# Altium schematic sheet sensor.SchDoc: Bison-Board
size A4; DrawnBy: mzy2364; Revision: V1.4
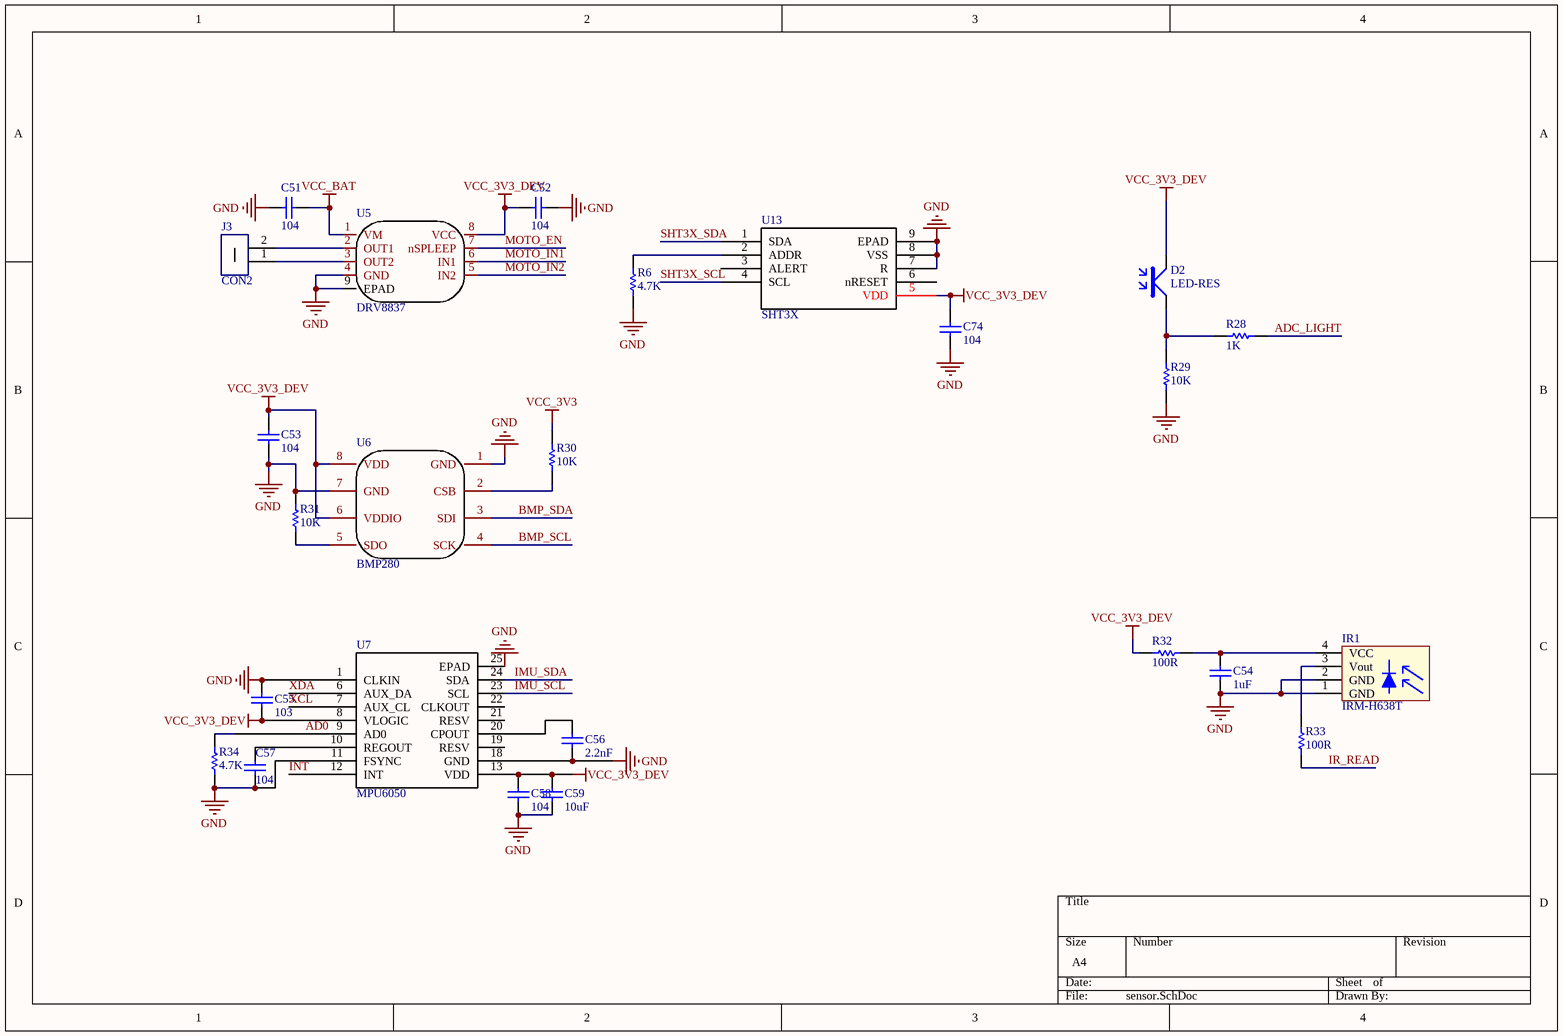
[diagram p0: sensor.SchDoc]

## Parts
C51  104  [C 0603]
C52  104  [C 0603]
C53  104  [C 0603]
C54  1uF  [C 0603]
C55  103  [C 0603]
C56  2.2nF  [C 0603]
C57  104  [C 0603]
C58  104  [C 0603]
C59  10uF  [C 0603]
C74  104  [C 0603]
D2  LED-RES  [LED 0805]
IR1  IRM-H638T  [IRM-H638T]
J3  CON2  [SMD_2P-1.25]
R6  4.7K  [R 0603]
R28  1K  [R 0603]
R29  10K  [R 0603]
R30  10K  [R 0603]
R31  10K  [R 0603]
R32  100R  [R 0603]
R33  100R  [R 0603]
R34  4.7K  [R 0603]
U5  DRV8837  [WSON-8]
U6  BMP280  [LGA-8]
U7  MPU6050  [QFN-24]
U13  SHT3X  [DFN-8]

## Nets
GND: C51.1 C52.2 C53.1 C54.2 C55.2 C56.2 C57.1 C58.1 C59.1 C74.2 IR1.1(GND) IR1.2(GND) R6.1 R29.1 R31.2 R34.1 U5.4(GND) U5.9(EPAD) U6.1(GND) U6.7(GND) U7.1(CLKIN) U7.11(FSYNC) U7.18(GND) U7.25(EPAD) U13.7(R) U13.8(VSS) U13.9(EPAD)
VCC_3V3: R30.2
VCC_3V3_DEV: C52.1 C53.2 C55.1 C58.2 C59.2 C74.1 D2.2 R32.1 U5.8(VCC) U6.6(VDDIO) U6.8(VDD) U7.8(VLOGIC) U7.13(VDD) U13.5(VDD)
VCC_BAT: C51.2 U5.1(VM)
AD0: R34.2 U7.9(AD0)
ADC_LIGHT: R28.2
BMP_SCL: U6.4(SCK)
BMP_SDA: U6.3(SDI)
IMU_SCL: U7.23(SCL)
IMU_SDA: U7.24(SDA)
INT: U7.12(INT)
IR_READ: R33.1
MOTO_EN: U5.7(nSPLEEP)
MOTO_IN1: U5.6(IN1)
MOTO_IN2: U5.5(IN2)
SHT3X_SCL: U13.4(SCL)
SHT3X_SDA: U13.1(SDA)
XCL: U7.7(AUX_CL)
XDA: U7.6(AUX_DA)
NetC54_1: C54.1 IR1.4(VCC) R32.2
NetC56_1: C56.1 U7.20(CPOUT)
NetC57_2: C57.2 U7.10(REGOUT)
NetD2_1: D2.1 R28.1 R29.2
NetIR1_3: IR1.3(Vout) R33.2
NetJ3_1: J3.1 U5.3(OUT2)
NetJ3_2: J3.2 U5.2(OUT1)
NetR6_2: R6.2 U13.2(ADDR)
NetR30_1: R30.1 U6.2(CSB)
NetR31_1: R31.1 U6.5(SDO)

Not connected (* = marked no-connect by the designer): U7 19(RESV) 21(RESV) 22(CLKOUT); U13 3(ALERT) 6(nRESET)

## Library data of the parts
C51-C54 C74 = CAP
C55-C59 = Cap: Capacitor; Published: *; LatestRevisionDate: *; LatestRevisionNote: *; PackageReference: *; Publisher: *
D2 = LRES: 光敏传感器
R6 R28-R34 = RES